# EAGLE schematic fibre_sensor_board (EAGLE 7.2.0)
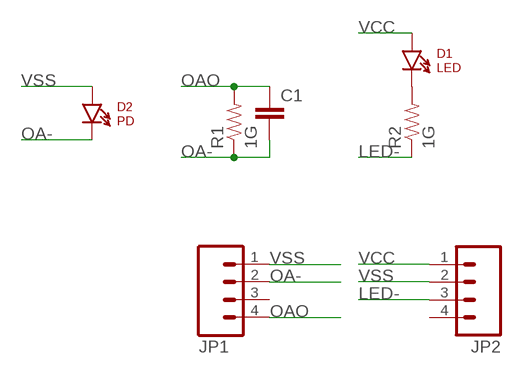
[diagram p0: schematic, sheet 1]

## Parts
C1  CAPPTH  [CAP-PTH-SMALL]
D1  LED  LTE-302  [LTE-302]
D2  PD  LTE-302  [LTE-302]
JP1  M04PTH  [1X04]
JP2  M04PTH  [1X04]
R1  1G  RESISTORAXIAL-0.3  [AXIAL-0.3]
R2  1G  RESISTORAXIAL-0.3  [AXIAL-0.3]

## Nets
LED-: JP2.3 R2.P$1
N$1: D1.C R2.P$2
OA-: C1.2 D2.C JP1.2 R1.P$1
OAO: C1.1 JP1.4 R1.P$2
VCC: D1.A JP2.1
VSS: D2.A JP1.1 JP2.2
Unconnected: JP1.3 JP2.4

## Library data of the parts
C1 = SparkFun-Capacitors:CAP: Capacitor Standard 0603 ceramic capacitor, and 0.1" leaded capacitor.
D1 D2 = SparkFun-LED:LTE-302: Through-hole side-firing 940nm IR LED
JP1 JP2 = SparkFun-Connectors:M04: Header 4 Standard 4-pin 0.1" header. Use with straight break away headers (SKU : PRT-00116), right angle break away headers (PRT-00553), swiss pins (PRT-00743), machine pins (PRT-00117), and female headers (PRT-00115). Molex polarized connector foot print use with SKU : PRT-08231 with associated crimp pins and housings. 1MM SMD Version SKU: PRT-10208
R1 R2 = SparkFun-Resistors:RESISTOR: Resistor Basic schematic elements and footprints for 0603, 1206, and PTH resistors.